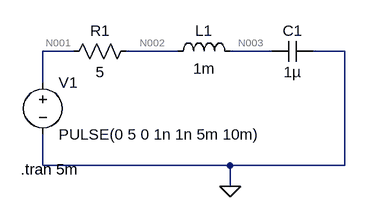
[diagram p0: schematic RLC.asc]
RLC.asc, the LTspice schematic file:
Version 4
SHEET 1 880 680
WIRE -48 64 -96 64
WIRE 112 64 32 64
WIRE 256 64 192 64
WIRE 368 64 320 64
WIRE -96 112 -96 64
WIRE -96 240 -96 192
WIRE 192 240 -96 240
WIRE 368 240 368 64
WIRE 368 240 192 240
WIRE 192 272 192 240
FLAG 192 272 0
SYMBOL res 48 48 R90
WINDOW 0 0 56 VBottom 2
WINDOW 3 32 56 VTop 2
SYMATTR InstName R1
SYMATTR Value 5
SYMBOL ind 96 80 R270
WINDOW 0 32 56 VTop 2
WINDOW 3 5 56 VBottom 2
SYMATTR InstName L1
SYMATTR Value 1m
SYMBOL cap 320 48 R90
WINDOW 0 0 32 VBottom 2
WINDOW 3 32 32 VTop 2
SYMATTR InstName C1
SYMATTR Value 1µ
SYMBOL voltage -96 96 R0
WINDOW 123 0 0 Left 0
WINDOW 39 0 0 Left 0
SYMATTR InstName V1
SYMATTR Value PULSE(0 5 0 1n 1n 5m 10m)
TEXT -130 246 Left 2 !.tran 5m

The netlist it stands for:
* RLC.asc
R1 N002 N001 5
L1 N002 N003 1m
C1 0 N003 1µ
V1 N001 0 PULSE(0 5 0 1n 1n 5m 10m)
.tran 5m
.backanno
.end

* Results of the author's LTspice run, read from the files saved beside the schematic
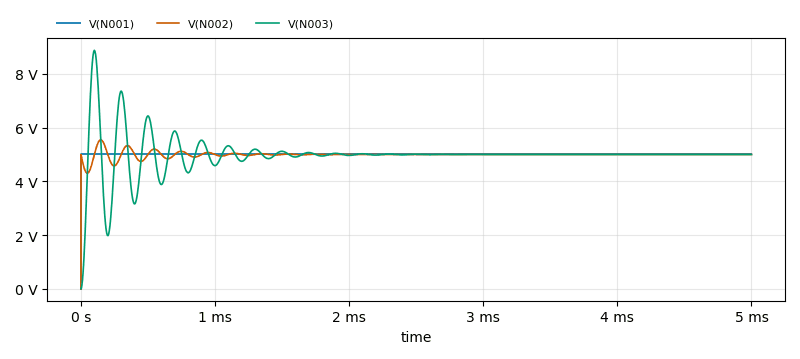
[diagram p1: Transient Analysis of RLC.asc, plotted from the saved traces]
* Transient Analysis, 1 run:
*   V(N001): min 0 V, max 5 V, average 5 V, rms 5 V, last 5 V
*   V(N002): min 0 V, max 5.545 V, average 4.995 V, rms 4.996 V, last 5 V
*   V(N003): min 0 V, max 8.877 V, average 4.995 V, rms 5.046 V, last 5 V